# Altium schematic sheet LEDs.SchDoc
size A4; DocumentNumber: 3; SheetNumber: ALT0056; SheetTotal: 21
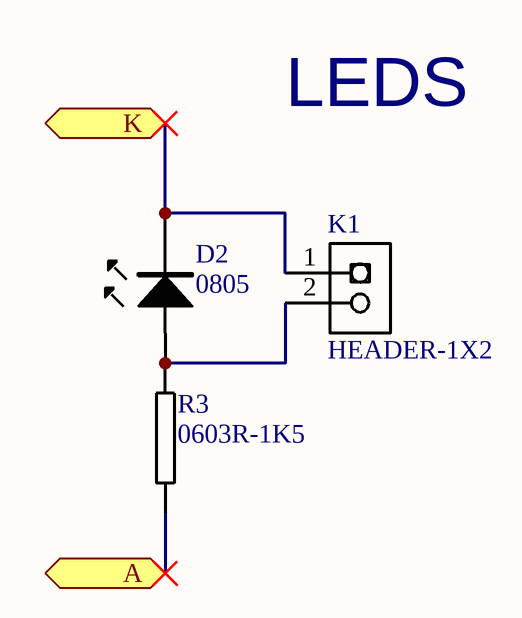
[diagram p0: LEDs.SchDoc]

## Parts
D2  0805  [0805LED]
K1  HEADER-1X2  [HEADER-1X2]
R3  0603R-1K5  [0603R-1k5]

## Ports
A, K

## Nets
A: R3.2 ; port A
K: D2.K K1.1 ; port K
NetD2_A: D2.A K1.2 R3.1

## Notes on the sheet
- LEDS
- Title
- Size:
- Date:
- A4
- Number:
- Time:
- Revision:
- Sheet
- of
- File:

## Library data of the parts
D2 = 0805_LED
K1 = HEADER-1X2: REEL: TH; Supplier 1: Digi-Key; Supplier Part Number 1: S1011E-36-ND
R3 = 0603R-1K5: GENERIC RESISTOR 0603; Manufacturer Part Number: RMCF 1/16 15K 1% R; Manufacturer: Stackpole Electronics Inc; Tolerance: ±1%; Resistance In Ohms: 15.0K; Power (Watts): 0.1W, 1/10W; Temperature Coefficient: ±100ppm/°C; Supplier 1: Digi-Key; Supplier Part Number 1: RMCF1/1615KFRTR-ND; Supplier: Digi-Key; Supplier Part Number: RMCF1/1615KFRTR-ND; Packaging: Tape & Reel (TR); Category: Resistors; Case: 0603 (1608 metric); Composition: Thick Film; Lead Style: Surface Mount (SMD - SMT); RoHS: RoHS Compliant